# EAGLE design Laptimer (EAGLE 6.3)
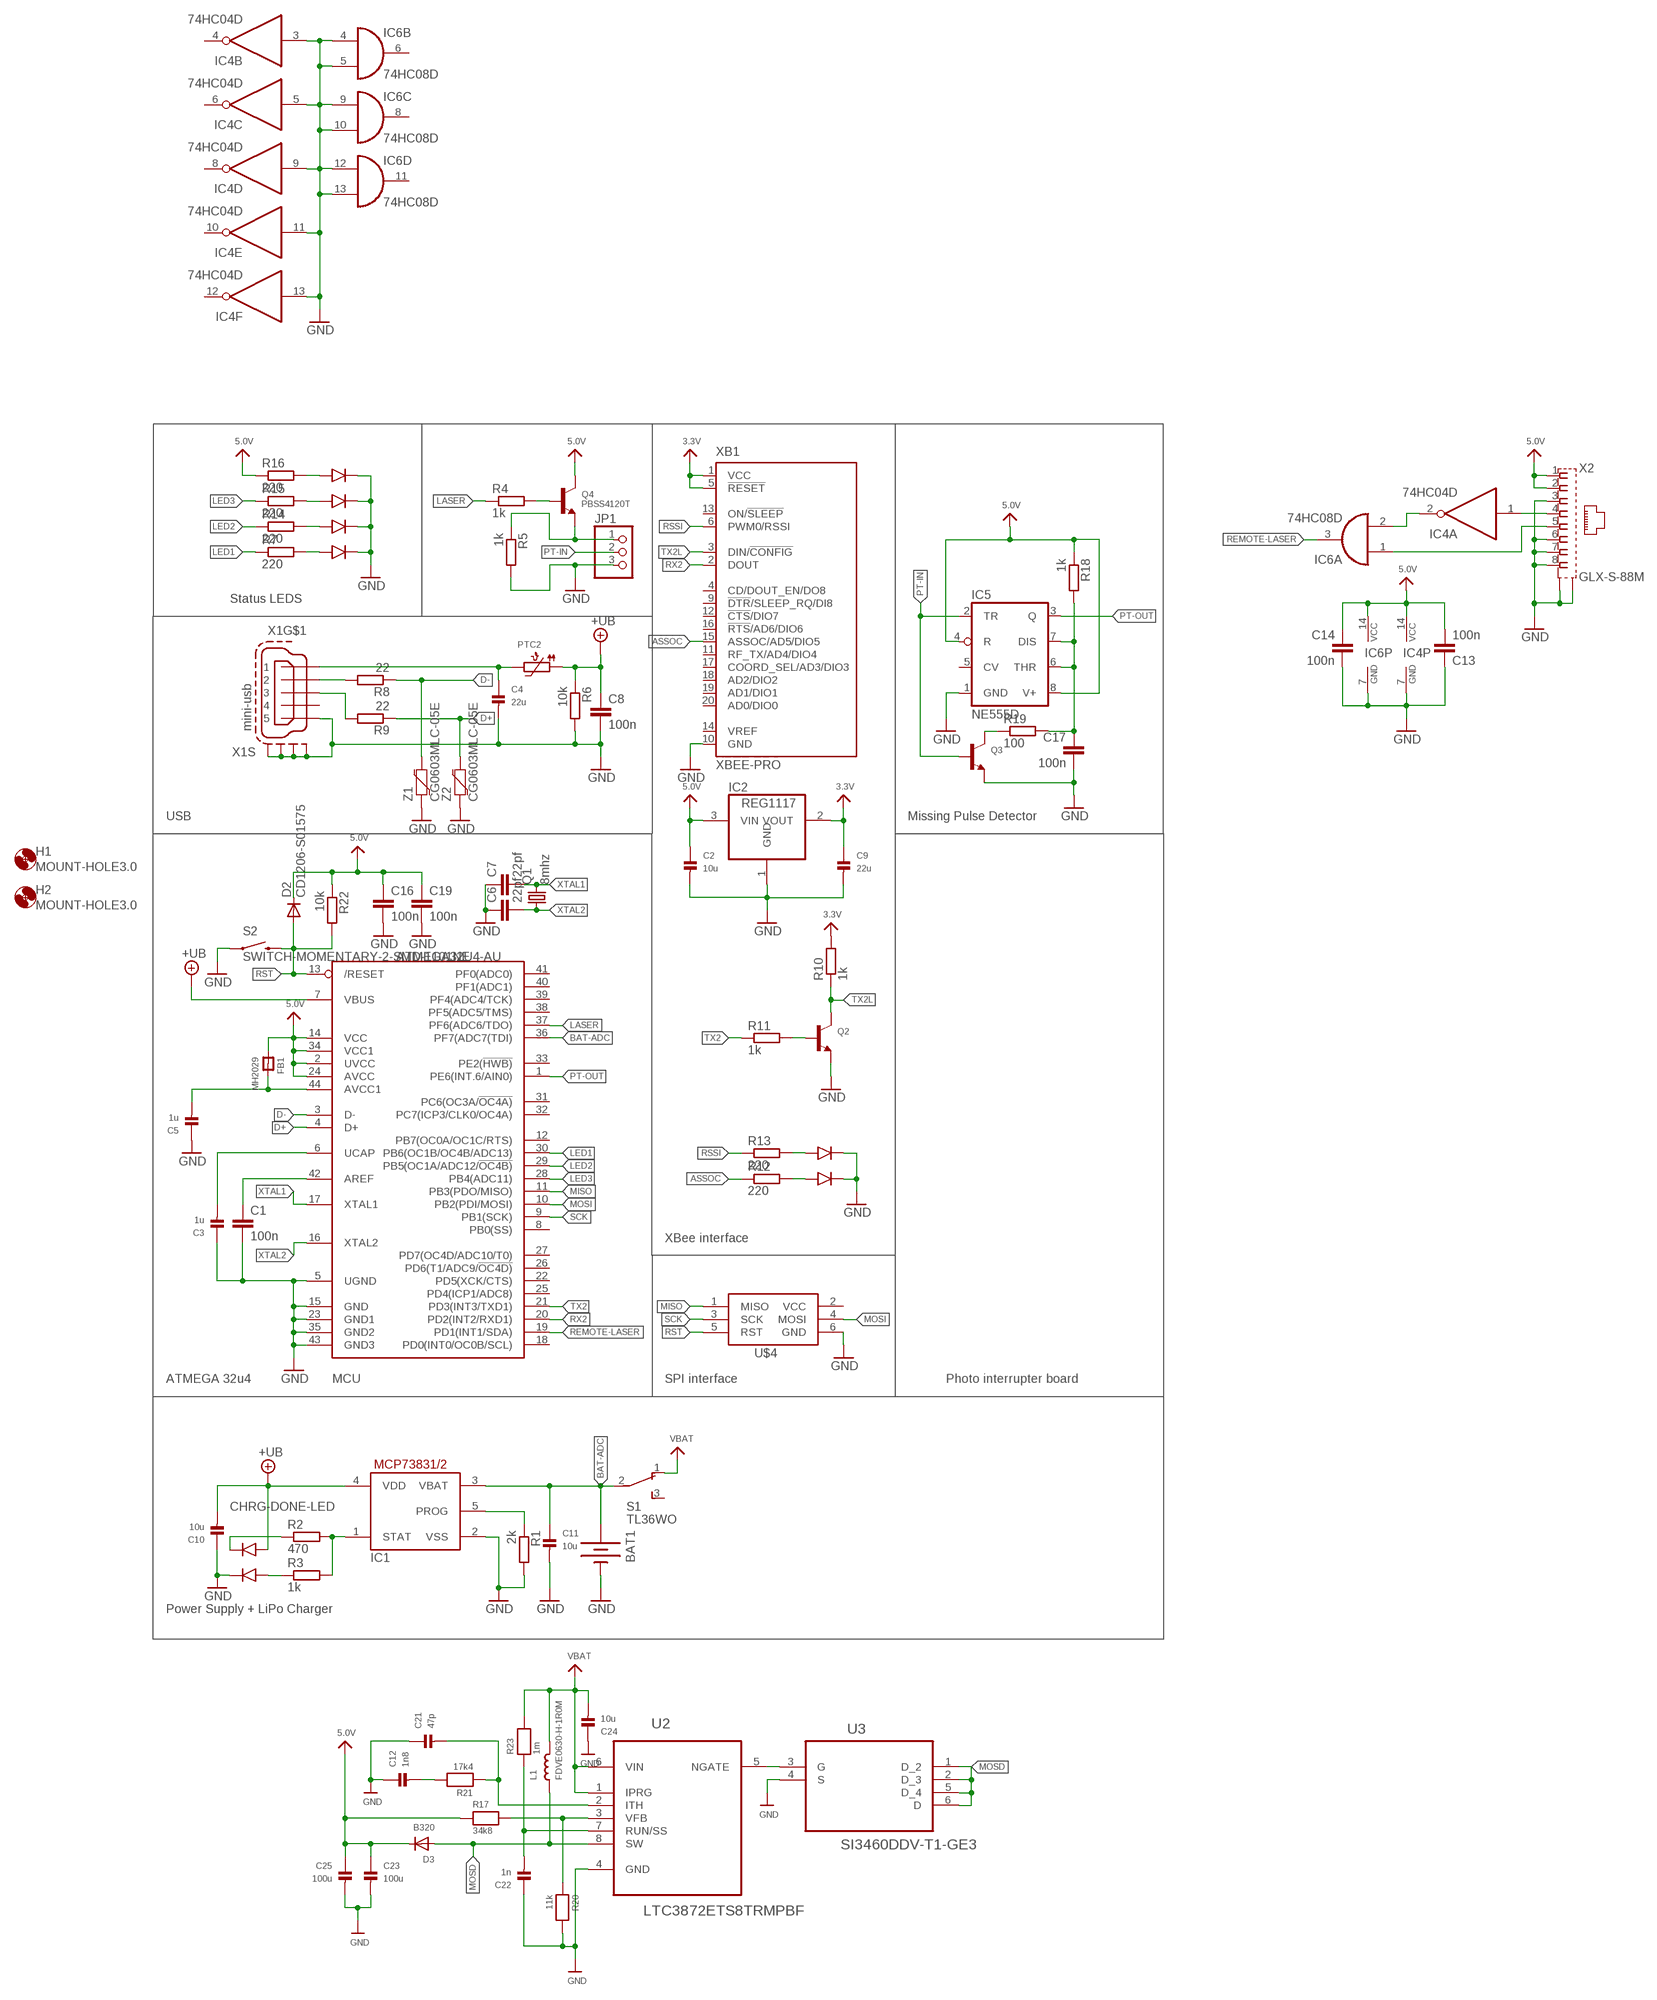
[diagram p0: schematic, sheet 1]

## Parts
BAT1  BATTERY18650  [BATTERY_18650-HOLDER]
C1  100n  C-EUC0603K  [C0603K]
C2  10u  CAP_CERAMIC_0805  [_0805]
C3  1u  CAP_CERAMIC_0805MP  [_0805MP]
C4  22u  CAP_CERAMIC_0805MP  [_0805MP]
C5  1u  CAP_CERAMIC_0805MP  [_0805MP]
C6  22pf  C-EUC0603K  [C0603K]
C7  22pf  C-EUC0603K  [C0603K]
C8  100n  C-EUC0603K  [C0603K]
C9  22u  CAP_CERAMIC_0805  [_0805]
C10  10u  CAP_CERAMIC_0805MP  [_0805MP]
C11  10u  CAP_CERAMIC_0805MP  [_0805MP]
C12  1n8  CAP_CERAMIC_0603  [_0603]
C13  100n  C-EUC0603K  [C0603K]
C14  100n  C-EUC0603K  [C0603K]
C16  100n  C-EUC0603K  [C0603K]
C17  100n  C-EUC0603K  [C0603K]
C19  100n  C-EUC0603K  [C0603K]
C21  47p  CAP_CERAMIC_0603  [_0603]
C22  1n  CAP_CERAMIC_0603  [_0603]
C23  100u  CAP_CERAMIC1206  [1206]
C24  10u  CAP_CERAMIC_0805  [_0805]
C25  100u  CAP_CERAMIC1206  [1206]
D2  CD1206-S01575  DIODE-MINIMELF  [MINIMELF]
D3  B320  DIODESMA  [SMADIODE]
FB1  MH2029  FERRITE_0805MP  [_0805MP]
H1  MOUNT-HOLE3.0  [3,0]
H2  MOUNT-HOLE3.0  [3,0]
IC1  MCP73831/OT  [SOT23-5L]
IC2  REG1117  [SOT223]
IC4  74HC04D  [SO14]
IC5  NE555D  [SO08]
IC6  74HC08D  [SO14]
JP1  PINHD-1X3  [1X03]
L1  FDVE0630-H-1R0M  INDUCTORTDK_SLF6045  [INDUCTOR_6X6MM_TDK_SLF6045]
MCU  ATMEGA32U4-AU  [TQFP44]
PTC2  PTC1206  [1206]
Q1  8mhz  CRYSTALHC49S  [HC49/S]
Q2  TRANSISTOR_NPNWIDE  [SOT23-WIDE]
Q3  TRANSISTOR_NPNWIDE  [SOT23-WIDE]
Q4  PBSS4120T  TRANSISTOR_NPNWIDE  [SOT23-WIDE]
R1  2k  R-EU_R0603  [R0603]
R2  470  R-EU_R0603  [R0603]
R3  1k  R-EU_R0603  [R0603]
R4  1k  R-EU_R0603  [R0603]
R5  1k  R-EU_R0603  [R0603]
R6  10k  R-EU_R0603  [R0603]
R7  220  R-EU_R0603  [R0603]
R8  22  R-EU_R0603  [R0603]
R9  22  R-EU_R0603  [R0603]
R10  1k  R-EU_R0603  [R0603]
R11  1k  R-EU_R0603  [R0603]
R12  220  R-EU_R0603  [R0603]
R13  220  R-EU_R0603  [R0603]
R14  220  R-EU_R0603  [R0603]
R15  220  R-EU_R0603  [R0603]
R16  220  R-EU_R0603  [R0603]
R17  34k8  RESISTOR_0603  [_0603]
R18  1k  R-EU_R0603  [R0603]
R19  100  R-EU_R0603  [R0603]
R20  11k  RESISTOR_0603  [_0603]
R21  17k4  RESISTOR_0603  [_0603]
R22  10k  R-EU_R0603  [R0603]
R23  1m  RESISTOR_0603  [_0603]
S1  TL36WO  [TL3XWO]
S2  SWITCH-MOMENTARY-2-SMD-1101NE  [TACTILE-SWITCH-1101NE]
U2  LTC3872ETS8TRMPBF  [SOT65P280X100-8N]
U3  SI3460DDV-T1-GE3  SI3457CDV-T1-GE3  [SOT95P285X110-6N]
U$1  BI-LEVEL-LED-INDICATOR  [BI-LEVEL-LED-INDICATOR]
U$4  AVRISP-BOX  [AVRISP-BOX]
U$11  BI-LEVEL-LED-INDICATOR  [BI-LEVEL-LED-INDICATOR]
U$18  BI-LEVEL-LED-INDICATOR  [BI-LEVEL-LED-INDICATOR]
U$19  BI-LEVEL-LED-INDICATOR  [BI-LEVEL-LED-INDICATOR]
X1  mini-usb  MINI-USB-SCHIELD-32005-301  [32005-301]
X2  GLX-S-88M  [GLX-S-88M]
XB1  XBEE-PRO  [XBEE-PRO]
Z1  CG0603MLC-05E  VARISTOR-0603  [0603-RES]
Z2  CG0603MLC-05E  VARISTOR-0603  [0603-RES]

## Nets
1D+: R9.2 X1.3
1D-: R8.2 X1.2
3.3V: C9.1 IC2.2(VOUT) R10.2 XB1.1(VCC) XB1.5(!RESET)
5.0V: C2.1 C13.2 C14.1 C16.1 C19.1 C23.1 C25.1 D2.C D3.C FB1.1 IC2.3(VIN) IC4.14(P:VCC) IC5.4(R) IC5.8(V+) IC6.14(P:VCC) MCU.2(UVCC) MCU.14(VCC) MCU.24(AVCC) MCU.34(VCC1) Q4.3(C) R16.1 R17.1 R18.1 R22.1 X2.1 X2.2
+UB: C8.1 C10.2 IC1.4(VDD) MCU.7(VBUS) PTC2.1 R6.1 U$1.ANODE1
ASSOC: R12.1 XB1.15(ASSOC/AD5/DIO5)
BAT-ADC: BAT1.PWR@1(+) C11.1 IC1.3(VBAT) MCU.36(PF7(ADC7(TDI)) S1.2(P)
CHRG-DONE-LED: R3.1 U$1.ANODE2
D+: MCU.4(D+) R9.1 Z2.2
D-: MCU.3(D-) R8.1 Z1.2
GND: BAT1.GND@1(-) C1.2 C2.2 C3.1 C4.2 C5.1 C6.1 C7.1 C8.2 C9.2 C10.1 C11.2 C12.1 C13.1 C14.2 C16.2 C17.2 C19.2 C21.1 C22.1 C23.2 C24.1 C25.2 IC1.2(VSS) IC2.1(GND) IC4.3(B:I) IC4.5(C:I) IC4.7(P:GND) IC4.9(D:I) IC4.11(E:I) IC4.13(F:I) IC5.1(GND) IC6.4(B:I0) IC6.5(B:I1) IC6.7(P:GND) IC6.9(C:I0) IC6.10(C:I1) IC6.12(D:I0) IC6.13(D:I1) JP1.3 MCU.5(UGND) MCU.15(GND) MCU.23(GND1) MCU.35(GND2) MCU.43(GND3) Q2.2(E) Q3.2(E) R1.2 R5.2 R6.2 R20.2 S2.P$1 U2.4(GND) U3.4(S) U$1.CATHODE2 U$4.6(GND) U$11.CATHODE1 U$11.CATHODE2 U$18.CATHODE1 U$18.CATHODE2 U$19.CATHODE1 U$19.CATHODE2 X1.5 X1.M1(S:S1) X1.M2(S:S2) X1.M3(S:S3) X1.M4(S:S4) X2.3 X2.6 X2.7 X2.8 X2.S1 X2.S2 XB1.10(GND) Z1.1 Z2.1
LASER: MCU.37(PF6(ADC6/TDO)) R4.1
LED1: MCU.30(PB6(OC1B/OC4B/ADC13)) R7.1
LED2: MCU.29(PB5(OC1A/ADC12/!OC4B)) R14.1
LED3: MCU.28(PB4(ADC11)) R15.1
MISO: MCU.11(PB3(PDO/MISO)) U$4.1(MISO)
MOSD: D3.A L1.P$1 U2.8(SW) U3.1(D_2) U3.2(D_3) U3.5(D_4) U3.6(D)
MOSI: MCU.10(PB2(PDI/MOSI)) U$4.4(MOSI)
N$1: R17.2 R20.1 U2.3(VFB)
N$2: C12.2 R21.2
N$3: IC1.5(PROG) R1.1
N$4: IC1.1(STAT) R2.2 R3.2
N$5: JP1.1 Q4.2(E) R5.1
N$6: Q4.1(B) R4.2
N$7: C5.2 FB1.2 MCU.44(AVCC1)
N$8: U2.5(NGATE) U3.3(G)
N$9: C1.1 MCU.42(AREF)
N$12: C3.2 MCU.6(UCAP)
N$13: C4.1 PTC2.2 X1.1
N$14: R2.1 U$1.CATHODE1
N$15: R7.2 U$18.ANODE1
N$17: R12.2 U$11.ANODE1
N$18: Q2.1(B) R11.2
N$19: R13.2 U$11.ANODE2
N$20: IC4.1(A:I) X2.4
N$21: R14.2 U$18.ANODE2
N$22: IC6.1(A:I0) X2.5
N$25: R15.2 U$19.ANODE1
N$27: C21.2 R21.1 U2.2(ITH)
N$28: IC4.2(A:O) IC6.2(A:I1)
N$29: C22.2 R23.1 U2.7(RUN/SS)
N$32: R16.2 U$19.ANODE2
N$36: C17.1 IC5.6(THR) IC5.7(DIS) R18.2 R19.2
N$41: Q3.3(C) R19.1
PT-IN: IC5.2(TR) JP1.2 Q3.1(B)
PT-OUT: IC5.3(Q) MCU.1(PE6(INT.6/AIN0))
REMOTE-LASER: IC6.3(A:O) MCU.19(PD1(INT1/SDA))
RSSI: R13.1 XB1.6(PWM0/RSSI)
RST: D2.A MCU.13(/RESET) R22.2 S2.P$2 U$4.5(RST)
RX2: MCU.20(PD2(INT2/RXD1)) XB1.2(DOUT)
SCK: MCU.9(PB1(SCK)) U$4.3(SCK)
TX2: MCU.21(PD3(INT3/TXD1)) R11.1
TX2L: Q2.3(C) R10.1 XB1.3(DIN/!CONFIG)
VBAT: C24.2 L1.P$2 R23.2 S1.1(O) U2.1(IPRG) U2.6(VIN)
XTAL1: C7.2 MCU.17(XTAL1) Q1.2
XTAL2: C6.2 MCU.16(XTAL2) Q1.1
Unconnected: IC4.4(B:O) IC4.6(C:O) IC4.8(D:O) IC4.10(E:O) IC4.12(F:O) IC5.5(CV) IC6.6(B:O) IC6.8(C:O) IC6.11(D:O) MCU.8(PB0(SS)) MCU.12(PB7(OC0A/OC1C/RTS)) MCU.18(PD0(INT0/OC0B/SCL)) MCU.22(PD5(XCK/CTS)) MCU.25(PD4(ICP1/ADC8)) MCU.26(PD6(T1/ADC9/!OC4D)) MCU.27(PD7(OC4D/ADC10/T0)) MCU.31(PC6(OC3A/!OC4A)) MCU.32(PC7(ICP3/CLK0/OC4A)) MCU.33(PE2(!HWB)) MCU.38(PF5(ADC5/TMS)) MCU.39(PF4(ADC4/TCK)) MCU.40(PF1(ADC1)) MCU.41(PF0(ADC0)) S1.3(S) X1.4 XB1.4(CD/DOUT_EN/DO8) XB1.9(!DTR!/SLEEP_RQ/DI8) XB1.11(RF_TX/AD4/DIO4) XB1.12(!CTS!/DIO7) XB1.13(ON/!SLEEP) XB1.14(VREF) XB1.16(!RTS!/AD6/DIO6) XB1.17(COORD_SEL/AD3/DIO3) XB1.18(AD2/DIO2) XB1.19(AD1/DIO1) XB1.20(AD0/DIO0)

## Notes on the sheet
- Status LEDS
- USB | Missing Pulse Detector
- XBee interface
- ATMEGA 32u4 | SPI interface | Photo interrupter board
- Power Supply + LiPo Charger

## Power pins joined to a net without a drawn wire
VCC: U$4.2(VCC)

## Library data of the parts
BAT1 = SparkFun-Electromechanical:BATTERY: Battery Holders Various common sizes : AA, AAA, 18650 (PRT-12895), 20mm coin cell and 12mm coin cell. 20MM_4LEGS, BATT-10373
C1 C6-C8 C13 C14 C16 C17 C19 = rcl:C-EU: CAPACITOR, European symbol
C2-C5 C9-C12 C21-C25 = microbuilder:CAP_CERAMIC: Ceramic Capacitors 0402 - 0402 Surface Mount Capacitors 16pF 50V 5% [Digikey: 445-4899-2-ND] 18pF 50V 5% [Digikey: 490-1281-2-ND] 22pF 50V 5% [Digikey: 490-1283-2-ND] 68pF 50V 5% [Digikey: 490-1289-2-ND] 0.1uF 10V 10% [Digikey: 490-1318-2-ND] 1.0uF 6.3V 10% [Digikey: 490-1320-2-ND] 0603 - 0603 Surface Mount Capacitors 16 pF 50V 5% [Digikey: 445-5051-2-ND] 22 pF 50V [Digikey: PCC220ACVTR-ND] 33 pF 50V 5% [Digikey: 490-1415-1-ND] 56pF 50V 5% [Digikey: 490-1421-1-ND] 220pF 50V 5% [Digikey: 445-1285-1-ND] 680 pF 50V 2200 pF 50V 5% C0G [Digikey: 445-1297-1-ND] 5600 pF 100V 5% X7R [Digikey: 478-3711-1-ND] 0.1 µF 25V 10% [Digikey: PCC2277TR-ND] 0.22 µF 16V 10% X7R [Digikey: 445-1318-1-ND] 1.0 µF 25V 10% [Digikey: 445-5146-2-ND] 0603 - RF Specific 3pF 250V +/-0.1pF RF [Digikey: 712-1347-1-ND] 18 pF 250V 5% [Digikey: 478-3505-1-ND or 712-1322-1-ND] 56 pF 250V 5% C0G RF [Digikey: 490-4867-1-ND] 68 pF 250V RF [Digikey: 490-4868-1-ND] 0805 - 0805 Surface Mount Capacitors 220 pF 250V 2% RF Ceramic Capacitor [Digikey: 712-1398-1-ND] 1000 pF 50V 2% NP0 Ceramic Capacitor [Digikey: 478-3760-1-ND] 0.1 µF 25V 10% Ceramic Capacitor [Digikey: PCC1828TR-ND] 1.0 µF 16V 10% Ceramic Capacitor[Digikey: 490-1691-2-ND] 10.0 µF 10V 10% Ceramic Capacitor[Digikey: 709-1228-1-ND] 10.0 uF 16V 10% Ceramic Capacitor [Digikey: 478-5165-2-ND] 47 uF 6.3V 20% Ceramic Capacitor [Digikey: 587-1779-1-ND or 399-5506-1-ND] 1206 - 1206 Surface Mount Capacitors 47uF 10V 20% Ceramic Capacitor [Digikey: 490-5528-1-ND or 399-5508-1-ND or 445-6010-1-ND] 100uF 6.3V -20%, +80% Y5V Ceramic Capacitor (Digikey: 490-4512-1-ND, Mouser: 81-GRM31CF50J107ZE1L)
D2 = diode:DIODE-: DIODE
D3 = adafruit:DIODE: Diode SMADIODE - SMA Surface Mount Package 20V 1A Schottky Diode Digikey: 641-1014-6-ND DO-1N4148 - Through Hole Small Current Diode SOD-123 20V 1 A (.5mV Vf) Schottky Diode - Digikey: MBRX120TPMSCT-ND SOD-323 10V 570mA (.38mV Vf, 3ns) Schottky Diode - Digikey: ZLLS410CT-ND SOD-523 30V 30mA Schottky Diode (RB751S-40TE61) - Digikey: RB751S-40TE61CT-ND SOT23-R/W - SOT23 Package (R = Solder Paste/Reflow Ovens, W = Hand-Soldering) BAT54Film 40V 300mA - Digikey: 497-7162-1-ND
FB1 = microbuilder:FERRITE: Ferrite Bead 0603 MMZ1608B121C - 120 Ohm @ 100MHz, 600mA, 0.15 Ohm DC Resistance - Digikey: 445-2164-1-ND BK1608HW121-T - 120 Ohm, 600mA Ferrite Chip - Digikey: 587-1876-2-ND 0805 HZ0805B272R-10 - 2.7K Ohm @ 100MHz, 200mA, 0.8 Ohm DC Resistance - Digikey: 240-2504-1-ND (see also Murata BLM21BD272SN1L) MMZ2012Y152B - 1.5K Ohm @ 100MHz, 500mA, 0.4 Ohm DC Resistance - Digikey: 445-1560-1-ND - Mainly for high frequency (80-400MHz) MMZ2012R102A - 1K Ohm @ 100MHz, 500mA, 0.3 Ohm DC Resistance - Digikey: 445-1555-2-ND - More general purpose (10-200MHz)
H1 H2 = holes:MOUNT-HOLE: MOUNTING HOLE with drill center marker
IC1 = adafruit:MCP73831: MCP73831/2 Miniature Single-Cell, Fully Integrated Li-Ion, Li-Polymer Charge Management Controllers. Nice and small simple lipoly charge controller, with adjustable current and status output (LED) http://www.ladyada.net/library/pcb/eaglelibrary.html
IC2 = burr-brown:REG1117: 800mA and 1A Low Dropout (LDO) Positive Regulator 1.8V, 2.5V, 2.85V, 3.3V, 5V, and Adj; MPN: REG1117; OC_FARNELL: 1097566; OC_NEWARK: 14P6981
IC4 = 74xx-eu:74*04: Hex INVERTER
IC5 = linear:*555: TIMER
IC6 = 74xx-eu:74*08: Quad 2-input AND gate
JP1 = adafruit:PINHD-1X3: PIN HEADER
L1 = microbuilder:INDUCTOR: Inductors 0603: 10nH Ceramic Inductor - microwire antenna/RF (Digikey: 712-1434-2-ND) 0805: 560nH Ceramic Inductor - RF (Digikey: 553-1047-1-ND) 270nH Ceramic Inductor - Q = 40@250MHz, +-5%, 1 Ohm DC Resistance (Digikey: 535-10506-2-ND) 1007 (2518 Metric) SMT: 10µH 10% 250mOhm 820mA 1007 Inductor (Digikey: 587-2189-1-ND) 22µH 10% 500mOhm 580mA 1007 Inductor (Digikey: 587-2190-1-ND) 47µH 10% 950mOhm 420mA 1007 Inductor (Digikey: 587-2191-1-ND) 47µH 5% 100mOhm 1A 1008 Inductor (Digikey: 732-1816-1-ND) 5.0x5.0mm (Taiyo Yuden NR5040 Series) 6.8µH 20% 2.3A 64mOhm Inductor (Digikey: 587-2374-2-ND) 5.0x5.0mm (TDK VLC5045 Series) 4.7µH 20% 3.3A 34mOhm Inductor (Digikey: 445-6526-1-ND) 6.8µH 20% 2.7A 46mOhm Inductor (Digikey: 445-6527-1-ND) 6.0x6.0mm (TDK VLC6045 Series) 4.7µH 20% 3.8A 27mOhm Inductor (Digikey: 445-6538-2-ND) 6.8µH 20% 3A 41mOhm Inductor (Digikey: 445-6540-1-ND) 6.2µH 30% 2.2A 45mOhm Inductor (Digikey: SRR5028-6R2YCT-ND) - Not TDK VLC6045 but footprint should match 6.0x6.0mm (TDK SLF6045 Series) 6.8uH 30% 2A 33mOhm Inductor (Digikey: 445-4572-1-ND, Mouser: 810-SLF645T6R8N2R0PF)
MCU = adafruit:ATMEGA32U4: http://www.ladyada.net/library/eagle
PTC2 = microbuilder:PTC: PTC (Resettable Fuse) 1206 Package 250mA PTC (16V Max, Time-to-Trip: 0.08s) - Digikey: F2110CT-ND 1210 Package 100mA PTC (30V Max, Time-to-Trip: 0.6s) - Digikey: MF-USMF010-2CT-ND 1812 Package 750mA PTC (24V Max, Time-to-Trip: 0.2s) - Digikey: MF-MSMF075/24-2CT-ND
Q1 = adafruit:CRYSTAL: CRYSTAL; OC_FARNELL: 1667008; OC_NEWARK: unknown
Q2-Q4 = microbuilder:TRANSISTOR_NPN: NPN Transistor Transistor (NPN) 500mA 45V - BC817 [Digikey: 568-1631-1-ND] Transistor (NPN) 500mA 45V - BC817,215 [Mouser: 771-BC817-T/R] SOT23-R - SOT23 footprint optimised for use with solder paste and reflow ovens. SOT23-W - SOT23 footprint optimised for hand-soldering (larger pads).
R1-R16 R18 R19 R22 = rcl:R-EU_: RESISTOR, European symbol
R17 R20 R21 R23 = microbuilder:RESISTOR: Resistors 0402 - 0402 Surface Mount Package 22 Ohm 1% 1/16W [Digikey: 311-22.0LRTR-ND] 33 Ohm 5% 1/16W 1.0K 5% 1/16W 1.5K 5% 1/16W 2.0K 1% 1/16W 10.0K 1% 1/16W [Digikey: 311-10.0KLRTR-ND] 10.0K 5% 1/16W [Digikey: RMCF0402JT10K0TR-ND] 12.1K 1% 1/16W [Digikey: 311-22.0LRTR-ND] 100.0K 5% 1/16W 0603 - 0603 Surface Mount Package 0 Ohm 1/10 Watt 1% Resistor 15 Ohm 1/10 Watt 1% Resistor 33 Ohm 1/10 Watt 1% Resistor 49.9 Ohm 1/10 Watt 1% Resistor 100 Ohm 1/10 Watt 1% Resistor 150 Ohm 1/10 Watt 1% Resistor 240 Ohm 1/10 Watt 1% Resistor 390 Ohm 1/10 Watt 1% Resistor 560 Ohm 1/10 Watt 1% Resistor 680 Ohm 1/10 Watt 1% Resistor 750 Ohm 1/10 Watt 1% Resistor 1.0K Ohm 1/10 Watt 1% Resistor 1.5K Ohm 1/10 Watt 1% Resistor 2.0K Ohm 1/10 Watt 1% Resistor 2.2K Ohm 1/10 Watt 1% Resistor 3.3K Ohm 1/10 Watt 1% Resistor 4.7K Ohm 1/10 Watt 1% Resistor 10.0K Ohm 1/10 Watt 1% Resistor 12.0K Ohm 1/10 Watt 1% Resistor 12.1K Ohm 1/10 Watt 1% Resistor 20.0K Ohm 1/10 Watt 1% Resistor 33.0K Ohm 1/10 Watt 1% Resistor 100.0K Ohm 1/10 Watt 1% Resistor 0805 - 0805 Surface Mount Package 0 Ohm 1/8 Watt 1% Resistor 33 Ohm 1/8 Watt 1% Resistor 100 Ohm 1/8 Watt 1% Resistor 150 Ohm 1/8 Watt 1% Resistor 200 Ohm 1/8 Watt 1% Resistor 240 Ohm 1/8 Watt 1% Resistor 330 Ohm 1/8 Watt 1% Resistor 390 Ohm 1/8 Watt 1% Resistor 470 Ohm 1/8 Watt 1% Resistor 1.0K Ohm 1/8 Watt 1% Resistor 1.5K Ohm 1/8 Watt 1% Resistor 2.0K Ohm 1/8 Watt 1% Resistor 4.7K Ohm 1/8 Watt 1% Resistor 5.1K Ohm 1/8 Watt 1% Resistor 5.6K Ohm 1/8 Watt 1% Resistor 10.0K Ohm 1/8 Watt 1% Resistor 22.0K Ohm 1/8 Watt 1% Resistor 33.0K Ohm 1/8 Watt 1% Resistor 100K Ohm 1/8 Watt 1% Resistor 1206 - 1206 Surface Mount Package 2012 - 2010 Surface Mount Package 0.11 Ohm 1/2 Watt 1% Resistor - Digikey: RHM.11UCT-ND
S1 = switch:TL36WO: TINY SWITCH ON - ON Source: http://www2.produktinfo.conrad.com/datenblaetter/700000-724999/705152-da-01-de-Subminiaturschalter_TL_36WO.pdf
S2 = SparkFun-Electromechanical:SWITCH-MOMENTARY-2: Various NO switches- pushbuttons, reed, etc
U2 = LTC_By_element14_Batch_1:LTC3872ETS8TRMPBF: DC/DC Controller; MPN: LTC3872ETS8#TRMPBF; OC_FARNELL: 1556409; OC_NEWARK: 56M8617; PACKAGE: SOT-23-8; SUPPLIER: LINEAR TECHNOLOGY
U3 = Vishay_By_element14_Batch_1:SI3457CDV-T1-GE3: N-Channel 30-V (D-S) MOSFET; MPN: SI3457CDV-T1-GE3; OC_FARNELL: 1840420; OC_NEWARK: 90R9127; PACKAGE: TSOP-6; SUPPLIER: Vishay Siliconix
U$1 U$11 U$18 U$19 = unicorn_v2:BI-LEVEL-LED-INDICATOR
U$4 = adafruit:AVRISP: AVR ISP HEADER Standard 6 pin header for AVR programming
X1 = con-cypressindustries:MINI-USB-SCHIELD-: MINI USB-B Conector Source: www.cypressindustries.com; OC_FARNELL: unknown; OC_NEWARK: unknown
X2 = con-kycon:GLX-S-88M: Mod. Jack, Right Angle, 8 posiotion, 8 contatcs RJ45 Source: GLX-S-88M.pdf; OC_FARNELL: unknown; OC_NEWARK: unknown
XB1 = microbuilder:XBEE: XBee (TM) /XBee-PRO(TM) OEM RF Modules Source: MaxStream, Inc. xbee_productmanual.pdf
Z1 Z2 = SparkFun-DiscreteSemi:VARISTOR: Varistor Varistor (Variable resistor) is a nonlinear resistive element of the voltage dependence that resistance changes with applied voltage. Varistor is equivalent with Zener diode of two series connection.

## Board
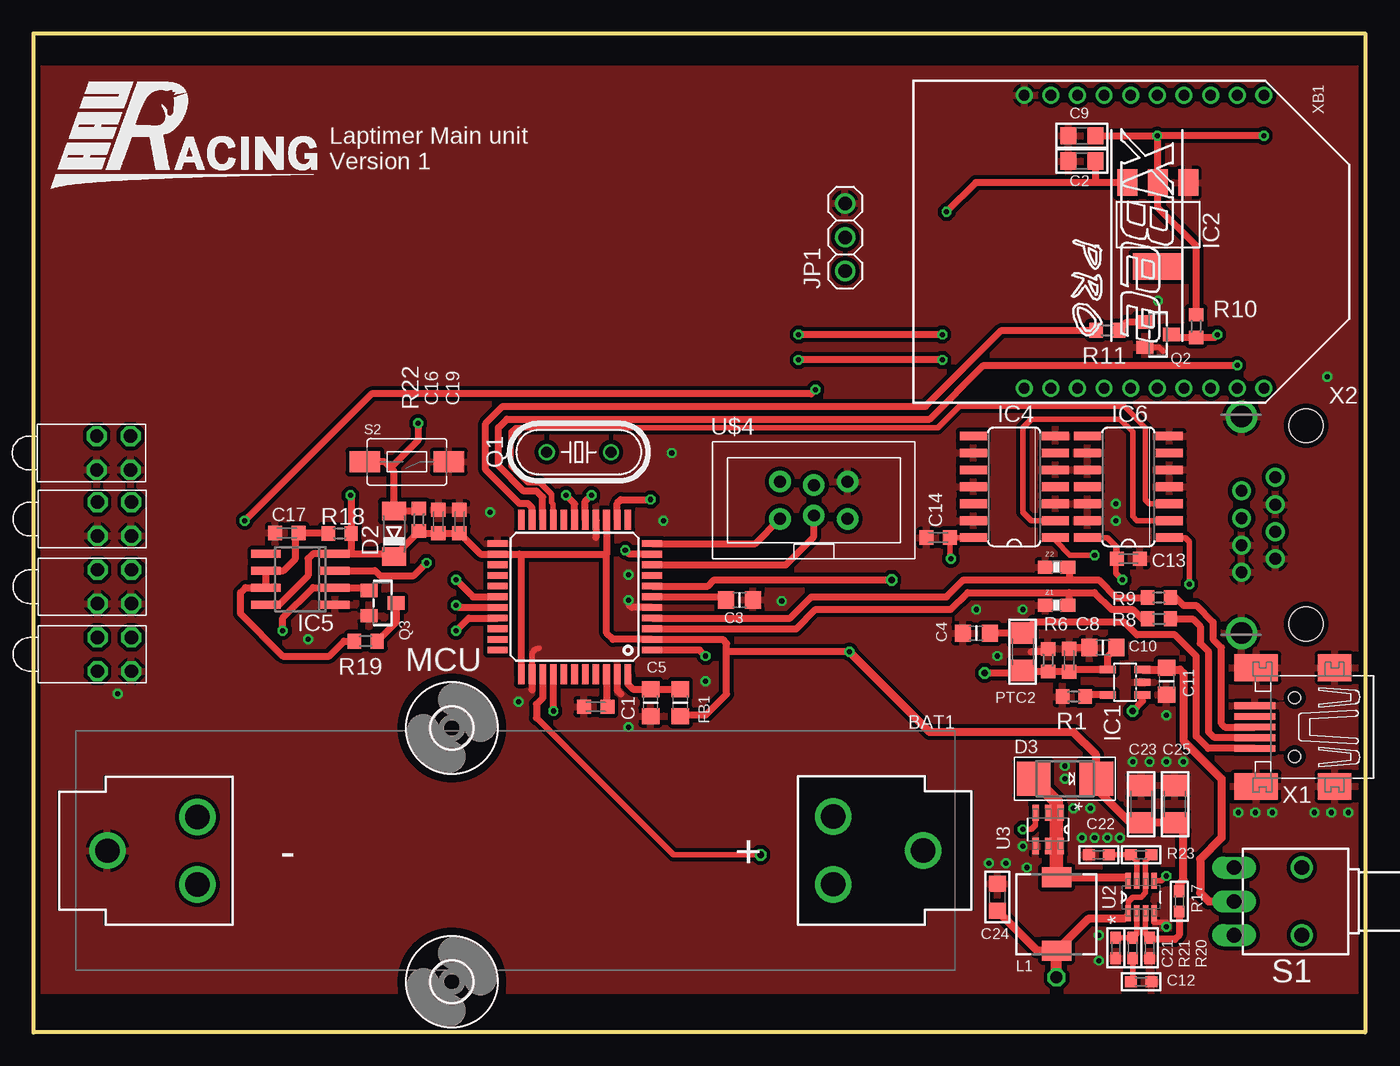
[diagram p1: board, top side]
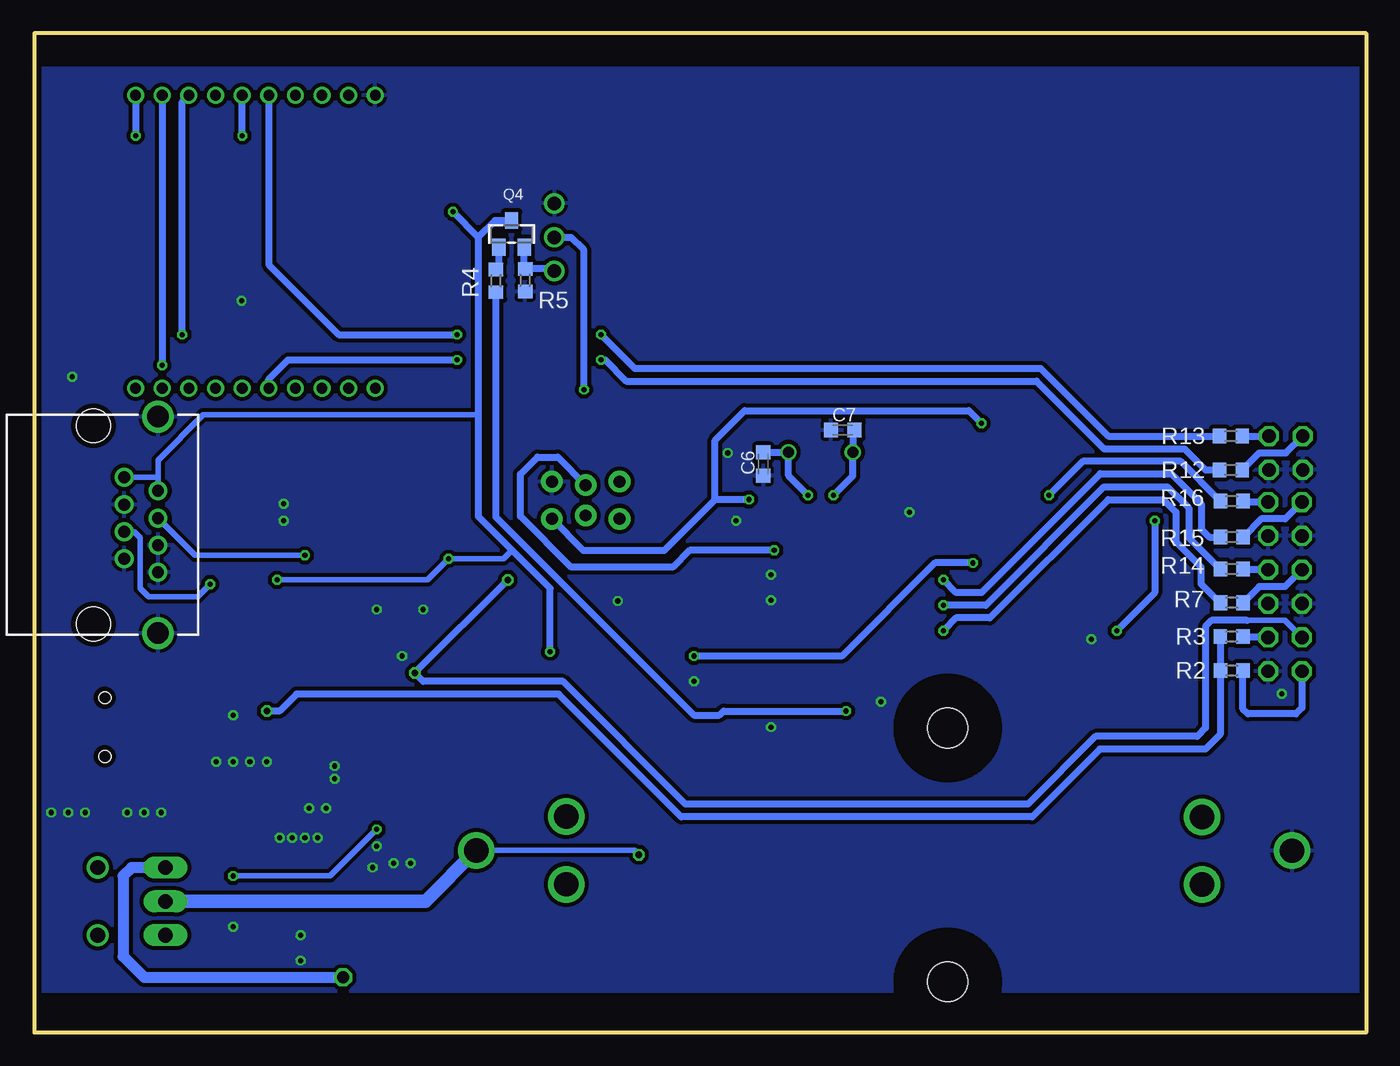
[diagram p2: board, bottom side, seen from below]

Size 100 x 75 mm. Coordinates in mm from the lower left corner, seen from the top.
Outline: 0,75 100,75 100,0 0,0 0,75
Copper layers (1*16): Top 0.0356mm / dielectric 1.5011mm / Bottom 0.0356mm
Design rules "LaenPCBOrder *": minimum track width 6mil, minimum drill 13mil, track to track 12mil, track to pad 12mil, pad to pad 12mil, via to via 12mil, smd to smd 12mil, copper to edge 15mil, drill to drill 6mil, minimum pad ring 7mil, minimum via ring 7mil, stop-mask expansion 3mil, vias tented up to drill 0mil, thermal gap 10mil

### Footprints (pad centres in the part's own frame; a part is rotated, then mirrored left to right if it is on the bottom)
BATTERY_18650-HOLDER = drill 1.829: GND@1 30.628,0.01; GND@2 23.88,2.55; GND@3 23.88,-2.53; PWR@1 -30.628,-0.01; PWR@2 -23.88,2.53; PWR@3 -23.88,-2.55
C0603K = smd 1.05 x 1.08: 1 -0.875,0; 2 0.875,0
_0805 = smd 1.2 x 1.3: 1 -1.016,0; 2 1.016,0
_0805MP = smd 1.2 x 1.3: 1 -1.016,0; 2 1.016,0
_0603 = smd 0.9 x 0.8: 1 -0.762,0; 2 0.762,0
1206 = smd 1.6 x 1.8: 1 -1.4,0; 2 1.4,0
MINIMELF = smd 1.4 x 1.8: A 1.7,0; C -1.7,0
SMADIODE = smd 2.54 x 2.54: A 2.349,0; C -2.349,0
3,0 = hole 3: 0,0
SOT23-5L = smd 0.55 x 1.2: 1 -0.95,-1.3; 2 0,-1.3; 3 0.95,-1.3; 4 0.95,1.3; 5 -0.95,1.3
SOT223 = smd 1.499 x 2.007: 1 -2.261,-3.15; 2 0.025,-3.15; 3 2.311,-3.15 | smd 3.81 x 2.007: 4 0,3.15
SO14 = smd 0.66 x 2.032: 1 -3.81,-3.073; 2 -2.54,-3.073; 3 -1.27,-3.073; 4 0,-3.073; 5 1.27,-3.073; 6 2.54,-3.073; 7 3.81,-3.073; 8 3.81,3.073; 9 2.54,3.073; 10 1.27,3.073; 11 0,3.073; 12 -1.27,3.073; 13 -2.54,3.073; 14 -3.81,3.073
SO08 = smd 0.6 x 2.2: 1 -1.905,-2.6; 2 -0.635,-2.6; 3 0.635,-2.6; 4 1.905,-2.6; 5 1.905,2.6; 6 0.635,2.6; 7 -0.635,2.6; 8 -1.905,2.6
1X03 = drill 1.016: 1 -2.54,0; 2 0,0; 3 2.54,0
INDUCTOR_6X6MM_TDK_SLF6045 = smd 1.5 x 2.2: P$1 -2.75,0; P$2 2.75,0
TQFP44 = smd 1.5 x 0.5: 1 -5.8,4; 2 -5.8,3.2; 3 -5.8,2.4; 4 -5.8,1.6; 5 -5.8,0.8; 6 -5.8,0; 7 -5.8,-0.8; 8 -5.8,-1.6; 9 -5.8,-2.4; 10 -5.8,-3.2; 11 -5.8,-4; 23 5.8,-4; 24 5.8,-3.2; 25 5.8,-2.4; 26 5.8,-1.6; 27 5.8,-0.8; 28 5.8,0; 29 5.8,0.8; 30 5.8,1.6; 31 5.8,2.4; 32 5.8,3.2; 33 5.8,4 | smd 0.5 x 1.5: 12 -4,-5.8; 13 -3.2,-5.8; 14 -2.4,-5.8; 15 -1.6,-5.8; 16 -0.8,-5.8; 17 0,-5.8; 18 0.8,-5.8; 19 1.6,-5.8; 20 2.4,-5.8; 21 3.2,-5.8; 22 4,-5.8; 34 4,5.8; 35 3.2,5.8; 36 2.4,5.8; 37 1.6,5.8; 38 0.8,5.8; 39 0,5.8; 40 -0.8,5.8; 41 -1.6,5.8; 42 -2.4,5.8; 43 -3.2,5.8; 44 -4,5.8
HC49/S = drill 0.813: 1 -2.413,0; 2 2.413,0
SOT23-WIDE = smd 1 x 1.27: 1 -0.95,-1; 2 0.95,-1; 3 0,1
R0603 = smd 1 x 1.1: 1 -0.85,0; 2 0.85,0
TL3XWO = drill 1.1 pad 1.422 long: 1 -2.54,-5.08; 2 0,-5.08; 3 2.54,-5.08 | drill 1.1 pad 1.676: M1 -2.54,0; M2 2.54,0
TACTILE-SWITCH-1101NE = smd 2.3 x 1.6: P$1 -3.15,0; P$2 3.15,0
SOT65P280X100-8N = smd 1.219 x 0.406: 1 -1.219,0.965; 2 -1.219,0.33; 3 -1.219,-0.33; 4 -1.219,-0.965; 5 1.219,-0.965; 6 1.219,-0.33; 7 1.219,0.33; 8 1.219,0.965
SOT95P285X110-6N = smd 1.219 x 0.508: 1 -1.245,0.94; 2 -1.245,0; 3 -1.245,-0.94; 4 1.245,-0.94; 5 1.245,0; 6 1.245,0.94
BI-LEVEL-LED-INDICATOR = drill 1 octagon: ANODE1 1.27,1.27; ANODE2 1.27,-1.27; CATHODE1 -1.27,1.27; CATHODE2 -1.27,-1.27
AVRISP-BOX = drill 0.9 pad 1.626: 1 -1.397,2.54; 2 1.397,2.54; 3 -1.143,0; 4 1.143,0; 5 -1.397,-2.54; 6 1.397,-2.54
32005-301 = smd 3.1 x 0.5: 1 3,1.6; 2 3,0.8; 3 3,0; 4 3,-0.8; 5 3,-1.6 | smd 2.5 x 2: M1 -3,-4.45; M2 -3,4.45 | smd 3.3 x 2: M3 2.9,4.45; M4 2.9,-4.45 | hole 0.9: 0,2.2; 0,-2.2
GLX-S-88M = drill 0.9 pad 1.422: 1 -3.57,-2.3; 2 -2.55,-4.84; 3 -1.53,-2.3; 4 -0.51,-4.84; 5 0.51,-2.3; 6 1.53,-4.84; 7 2.55,-2.3; 8 3.57,-4.84 | drill 1.6 pad 2.184: S1 -8.125,-4.84; S2 8.125,-4.84 | hole 2.55: -7.44,0; 7.44,0
XBEE-PRO = drill 0.8 pad 1.27: 1 -11,9; 2 -11,7; 3 -11,5; 4 -11,3; 5 -11,1; 6 -11,-1; 7 -11,-3; 8 -11,-5; 9 -11,-7; 10 -11,-9; 11 11,-9; 12 11,-7; 13 11,-5; 14 11,-3; 15 11,-1; 16 11,1; 17 11,3; 18 11,5; 19 11,7; 20 11,9
0603-RES = smd 1.1 x 1: 1 -0.85,0; 2 0.85,0

### Placement (x,y rotation side)
BAT1  36.2,13.65 180 top
C1  42.23,24.45 180 top
C2  78.74,65.41 180 top
C3  53.03,32.46 180 top
C4  70.8,29.97 180 top
C5  46.35,24.77 90 top
C6  45.28,42.67 90 bottom
C7  39.3,45.21 0 bottom
C8  77.79,27.94 90 top
C9  78.74,67.31 180 top
C10  80.33,28.89 0 top
C11  85.09,26.35 270 top
C12  83.19,3.81 180 top
C13  82.23,35.56 180 top
C14  67.94,37.15 180 top
C16  30.42,38.35 90 top
C17  19.05,37.5 180 top
C19  32,38.35 90 top
C21  81.28,6.35 90 top
C22  80.01,13.34 0 top
C23  83.19,17.14 90 top
C24  72.39,10.16 270 top
C25  85.72,17.14 90 top
D2  27.08,37.44 90 top
D3  77.47,19.05 180 top
FB1  48.58,24.77 90 top
H1  31.43,22.86 0 top
H2  31.43,3.81 0 top
IC1  81.99,26.29 90 top
IC2  84.45,60.64 180 top
IC4  73.66,40.96 90 top
IC5  20.07,34.03 90 top
IC6  82.23,40.96 90 top
JP1  60.96,59.69 90 top
L1  76.83,8.89 270 top
MCU  40.65,32.7 180 top
PTC2  74.3,28.57 90 top
Q1  40.96,43.56 180 top
Q2  84.45,52.39 270 top
Q3  26.23,32.23 270 top
Q4  64.17,59.95 0 bottom
R1  78.14,25.22 180 top
R2  10.1,27.17 180 bottom
R3  10.11,29.72 180 bottom
R4  65.35,56.42 90 bottom
R5  63.15,56.47 270 bottom
R6  76.2,27.94 90 top
R7  10.1,32.26 0 bottom
R8  84.53,31.05 0 top
R9  84.53,32.64 0 top
R10  87.31,53.02 90 top
R11  80.64,52.7 0 top
R12  10.16,42.23 0 bottom
R13  10.16,44.77 0 bottom
R14  10.1,34.8 0 bottom
R15  10.1,37.18 0 bottom
R16  10.1,39.88 0 bottom
R17  86.04,9.84 270 top
R18  23.02,37.46 180 top
R19  24.96,29.37 180 top
R20  83.82,6.35 270 top
R21  82.55,6.35 270 top
R22  28.96,38.49 90 top
R23  83.19,13.34 0 top
S1  95.25,9.84 270 top
S2  28.05,42.83 180 top
U2  83.19,10.16 90 top
U3  76.2,15.24 270 top
U$1  6.1,28.38 90 top
U$4  58.61,39.95 90 top
U$11  6.03,43.5 90 top
U$18  6.1,33.46 90 top
U$19  6.1,38.54 90 top
X1  94.72,22.92 180 top
X2  95.57,38.1 270 top
XB1  83.41,59.35 270 top
Z1  76.83,32.07 0 top
Z2  76.83,34.92 0 top

### Tracks (layer width: path | path; a pad name or v marks a point on that pad's centre or on a via)
1D+
  Top 0.508: X1.3 89.47,22.92 89.22,23.18 89.22,28.89 88.58,29.53 88.58,30.8 87.31,32.07 86.36,32.07 85.79,32.64 R9.2
1D-
  Top 0.508: X1.2 88.68,22.12 88.27,22.54 88.27,28.57 87.63,29.21 87.63,30.48 87.06,31.05 R8.2
3.3V  (via drill 0.38)
  Top 0.508: v84.39,67.31 84.43,66.71 IC2.2 84.45,63.77 84.45,61.91 87.31,59.05 R10.2 | C9.1 v84.39,67.31 | v92.39,67.31 v84.39,67.31
  Bottom 0.508: v84.39,67.31 84.41,67.36 XB1.5 | XB1.1 92.39,70.34 v92.39,67.31
5.0V  (via drill 0.38)
  Top 0.406: C13.2 81.36,36.44 81.28,36.51 | IC4.14 C14.1 68.82,35.64 v68.9,35.56 | IC6.14 80.64,37.15 81.28,36.51 | 81.28,36.51 81.28,34.48 v81.79,33.97
  Top 0.508: FB1.1 48.64,23.81 50.48,23.81 52.07,25.4 52.07,28.57 | MCU.14 43.05,35.9 | 36.51,35.9 MCU.24 33.57,35.9 C19.1 C16.1 29.12,37.47 R22.1 28.96,37.61 D2.C 26.89,35.93 23.87,35.93 | 36.51,35.9 43.05,35.9 | MCU.34 36.65,35.77 36.51,35.9 | 43.05,35.9 43.05,29.98 43.52,29.5 MCU.2 51.78,29.5 52.07,29.21 52.07,28.57 | 23.87,35.93 R18.1 23.87,40.27 v23.81,40.32 | 23.87,35.93 IC5.4 21.01,35.93 20.64,35.56 20.64,34.29 18.47,32.12 IC5.8 | IC2.3 79.69,63.79 | 79.69,63.79 70.78,63.79 v68.58,61.59 | C2.1 79.76,63.86 79.69,63.79 | v61.28,28.57 52.07,28.57
  Top 0.61: 86.04,15.43 C25.1 | C25.1 C23.1 82.36,15.74 79.82,18.29 D3.C 79.82,20.83 78.11,22.54 67.31,22.54 v61.28,28.57 | R17.1 86.04,11.11 86.36,11.43 86.36,15.11 C25.1
  Bottom 0.406: X2.1 90.73,41.67 | X2.2 90.73,41.67 | 90.73,41.67 90.73,42.94 87.31,46.35 66.67,46.35 | 64.14,36.2 64.77,35.56 v68.9,35.56 70.48,33.97 v81.79,33.97
  Bottom 0.508: Q4.3 65.42,60.95 66.67,59.69 | 66.67,59.69 66.67,46.35 66.67,38.73 64.14,36.2 61.28,33.34 v61.28,28.57 | v68.58,61.59 66.67,59.69 | R16.1 13.93,42.86 21.27,42.86 v23.81,40.32
+UB  (via drill 0.5)
  Top 0.508: MCU.7 50.65,33.5 51.12,33.97 v64.45,33.97 | C10.2 80.69,28.23 IC1.4 77.96,27.24 C8.1 76.22,27.07 R6.1 74.38,27.09 PTC2.1 73.85,27.18 73.66,26.99 v71.44,26.99
  Bottom 0.406: U$1.ANODE1 6.1,30.92 8.95,30.92
  Bottom 0.508: v64.45,33.97 v71.44,26.99 70.8,26.35 60.33,26.35 51.12,17.14 25.4,17.14 20.32,22.23 12.7,22.23 12.06,22.86 12.06,30.48 11.62,30.92 8.95,30.92
ASSOC  (via drill 0.38)
  Top 0.508: v68.26,50.48 v57.47,50.48
  Bottom 0.508: XB1.15 82.41,49.04 80.96,50.48 v68.26,50.48 | v57.47,50.48 57.15,50.48 55.56,48.9 24.77,48.9 19.68,43.81 13.65,43.81 12.06,42.23 R12.1
BAT-ADC  (via drill 0.5)
  Top 0.406: 37.78,23.62 48.07,13.34 v54.61,13.34
  Top 0.508: MCU.36 38.25,25.1 37.78,24.64 37.78,23.62
  Top 0.61: IC1.3 84.96,27.24 | 84.96,27.24 C11.1 | 84.96,27.24 86.11,27.24 86.36,26.99 86.36,21.91 89.22,19.05 89.22,14.61 87.63,13.02 87.63,10.48 88.27,9.84 S1.2
  Bottom 0.406: v54.61,13.34 54.94,13.66 BAT1.PWR@1
  Bottom 1.016: BAT1.PWR@1 70.64,9.84 S1.2
CHRG-DONE-LED
  Bottom 0.508: U$1.ANODE2 9.19,29.65 R3.1
D+
  Top 0.508: 77.79,33.97 69.85,33.97 68.58,32.7 58.42,32.7 56.82,31.1 MCU.4 | 77.79,33.97 80.01,33.97 81.34,32.64 R9.1 | Z2.2 77.79,34.82 77.79,33.97
D-
  Top 0.508: MCU.3 57.29,30.3 58.74,31.75 68.9,31.75 70.17,33.02 77.79,33.02 | 77.79,33.02 79.69,33.02 80.96,31.75 82.55,31.75 83.25,31.05 R8.1 | Z1.2 77.79,32.17 77.79,33.02
GND  (via drill 0.38)
  Top 0.406: 37.45,25.74 37.45,28.3 arc-90 37.97,28.83 | Q2.2 84.52,51.44 84.84,51.12 | U2.4 84.15,8.27 84.14,8.26 85.09,8.26
  Top 0.508: MCU.43 43.85,25.69 44.13,25.4 | MCU.35 37.45,25.74 37.47,25.72 | MCU.15 42.25,37.17 42.23,37.15 | MCU.5 44.93,31.9 44.77,32.07 | C10.1 77.86,28.89 C8.2 | 75.98,28.57 74.93,28.57
  Top 0.61: R6.2 75.98,28.57
  other vias: 47.94,43.5 6.34,25.42 47.31,38.42 50.48,26.35 20.64,29.53 97.16,49.21 34.29,39.05 84.45,54.93 56.2,32.38 36.45,24.83 44.7,34.35 44.7,32.45 44.7,22.92 81.28,38.42 81.28,39.69 74.3,31.75 70.8,31.75 72.39,28.26 85.09,23.81 77.47,20 77.47,19.05 78.11,16.83 79.38,16.83 78.74,14.61 79.69,14.61 80.64,14.61 81.6,14.61 74.3,13.97 74.61,12.38 73.03,12.7 71.75,12.7 80.01,5.4 80.01,7.3 82.55,20.32 83.82,20.32 85.09,20.32 86.36,20.32 85.09,7.94 90.49,16.51 91.76,16.51 93.03,16.51 98.74,16.51 97.47,16.51 96.2,16.51
  pour Top: 0,72.33 100.14,72.33 100.14,3.12 0.13,3.12
  pour Bottom: 0,72.33 100.14,72.33 100.14,3.12 0.13,3.12
LASER  (via drill 0.38)
  Top 0.508: v39.05,24.13 MCU.37
  Bottom 0.508: v39.05,24.13 48.26,24.13 48.58,23.81 50.48,23.81 65.35,38.68 R4.1
LED1  (via drill 0.38)
  Top 0.508: v31.75,30.16 32.69,31.1 MCU.30
  Bottom 0.508: R7.1 10.99,32.26 12.38,33.66 12.38,34.92 14.29,36.83 14.29,39.05 15.24,40.01 19.37,40.01 28.26,31.11 30.8,31.11 v31.75,30.16
LED2  (via drill 0.38)
  Top 0.508: v31.75,32.07 31.91,31.9 MCU.29
  Bottom 0.508: R14.1 10.99,34.8 13.34,37.15 13.34,39.37 14.92,40.96 19.68,40.96 28.57,32.07 v31.75,32.07
LED3  (via drill 0.38)
  Top 0.508: v31.75,33.97 33.02,32.7 MCU.28
  Bottom 0.508: v31.75,33.97 30.8,33.02 28.89,33.02 19.97,41.95 14.64,41.95 12.38,39.69 12.38,37.78 11.78,37.18 R15.1
MISO
  Top 0.508: MCU.11 54.22,36.7 U$4.1
MOSD
  Top 0.406: U3.5 U3.6 77.11,15.24 76.83,15.24 | 76.83,16.51 76.81,16.48 U3.2 | 82.11,11.65 82.2,11.62 U2.8
  Top 0.508: 76.83,16.51 77.11,16.51 U3.1
  Top 0.61: L1.P$1 82.06,11.64 82.11,11.65
  Top 1.016: L1.P$1 76.83,15.24 76.83,16.51 76.83,17.34 D3.A
MOSI  (via drill 0.38)
  Top 0.508: MCU.10 44.74,35.9 v44.45,36.2
  Bottom 0.508: v44.45,36.2 50.8,36.2 52.07,34.92 59.69,34.92 63.5,38.73 63.5,41.91 62.23,43.18 60.7,43.18 U$4.4
N$1
  Top 0.406: U2.3 83.52,7.42 R20.1
  Top 0.508: R17.2 86.04,7.3 85.72,6.99 83.95,6.99 R20.1
N$2
  Top 0.406: C12.2 82.55,3.94 R21.2
N$3
  Top 0.508: IC1.5 79.11,25.34 R1.1
N$4  (via drill 0.5)
  Top 0.508: v82.55,24.13 83.28,24.86 IC1.1
  Bottom 0.508: R3.2 10.96,27.18 | 10.96,27.18 R2.2 | 10.96,27.18 10.96,22.38 12.06,21.27 20,21.27 25.08,16.19 51.44,16.19 60.64,25.4 80.33,25.4 81.6,24.13 v82.55,24.13
N$5
  Bottom 0.508: JP1.1 61.13,57.32 R5.1 63.23,57.39 Q4.2
N$6
  Bottom 0.508: R4.2 65.12,57.49 Q4.1
N$7
  Top 0.508: MCU.44 44.65,26.16 45.02,25.78 C5.2 FB1.2
N$8  (via drill 0.38)
  Top 0.406: U2.5 84.72,11.38 v85.09,11.75 | v74.3,15.24 74.93,15.24 75.25,15.56 75.25,16.47 U3.3
  Bottom 0.406: v85.09,11.75 77.79,11.75 v74.3,15.24
N$9
  Top 0.508: MCU.42 43.05,24.5 C1.1
N$12
  Top 0.508: MCU.6 51.82,32.7 C3.2
N$13
  Top 0.508: X1.1 88.21,21.32 87.31,22.23 87.31,28.26 85.72,29.84 82.87,29.84 81.92,30.8 75.12,30.8 PTC2.2 C4.1
N$14
  Bottom 0.508: U$1.CATHODE1 4.83,24.36 5.28,23.91 8.89,23.91 9.25,24.27 R2.1
N$15
  Bottom 0.508: U$18.ANODE1 6.1,33.47 8.04,33.47 R7.2
N$17
  Bottom 0.508: R12.2 8.04,43.5 6.03,43.5 U$11.ANODE1
N$18
  Top 0.508: R11.2 82.13,53.34 Q2.1
N$19
  Bottom 0.508: R13.2 U$11.ANODE2
N$20  (via drill 0.38)
  Top 0.406: IC4.1 76.73,36.93 77.85,35.81 v79.69,35.81
  Bottom 0.406: v79.69,35.81 87.93,35.81 X2.4
N$21
  Bottom 0.508: U$18.ANODE2 9.18,34.73 R14.2
N$22  (via drill 0.38)
  Top 0.406: v86.81,33.66 86.81,36.83 86.49,37.15 IC6.1
  Bottom 0.406: X2.5 92.52,37.59 92.08,37.15 92.08,33.34 91.44,32.7 87.76,32.7 v86.81,33.66
N$25
  Bottom 0.508: U$19.ANODE1 6.09,38.55 7.88,38.55 R15.2
N$27
  Top 0.406: U2.2 82.86,7.42 R21.1 C21.2
N$28
  Top 0.406: IC6.2 82.87,38.42 82.55,38.73 82.55,45.09 81.6,46.04 74.93,46.04 74.3,45.4 74.3,39.05 74.93,38.42 IC4.2
N$29
  Top 0.406: U2.7 82.86,12.9 R23.1 C22.2
N$32
  Bottom 0.508: U$19.ANODE2 9.25,39.81 R16.2
N$36
  Top 0.508: R18.2 22.12,37.5 C17.1 19.68,37.26 19.68,35.56 18.79,34.66 IC5.6 IC5.7 15.93,33.39 15.56,33.02 15.56,31.43 18.73,28.26 22.23,28.26 23.34,29.37 R19.2
N$41
  Top 0.508: Q3.3 27.23,30.79 R19.1
PT-IN  (via drill 0.38)
  Top 0.508: Q3.1 25.23,33.39 IC5.2 21.01,33.39 18.73,31.11 v18.73,30.16 | v15.88,38.42 25.4,47.94 58.42,47.94 v58.74,48.26
  Bottom 0.508: JP1.2 59.69,59.69 58.74,58.74 v58.74,48.26 | v15.88,38.42 15.88,33.02 v18.73,30.16
PT-OUT  (via drill 0.38)
  Top 0.508: IC5.3 25.66,34.66 26.04,34.29 28.57,34.29 v29.53,35.24 | v50.48,28.26 50.04,28.7 MCU.1
  Bottom 0.508: v29.53,35.24 32.38,35.24 39.37,28.26 v50.48,28.26
REMOTE-LASER
  Top 0.406: MCU.19 39.05,39.66 38.92,39.78 38.92,40.42 38.07,41.27 37.15,41.27 35.88,42.55 35.88,45.09 36.2,45.4 67.94,45.4 69.53,46.99 81.92,46.99 83.5,45.4 83.5,40.01 83.82,39.69 IC6.3
RSSI  (via drill 0.38)
  Top 0.508: v68.26,52.39 v57.47,52.39
  Bottom 0.508: XB1.6 82.41,57.64 77.15,52.39 v68.26,52.39 | v57.47,52.39 54.93,49.85 24.45,49.85 19.37,44.77 R13.1
RST  (via drill 0.38)
  Top 0.508: R22.2 28.76,39.14 D2.A 27.08,42.13 26.83,42.39 | MCU.13 43.85,39.72 44.13,40.01 v46.35,40.01 | 26.83,42.39 26.38,42.83 S2.P$2 | v28.89,45.72 28.89,44.45 26.83,42.39
  Bottom 0.508: v46.35,40.01 48.9,40.01 | 48.9,40.01 48.9,44.45 46.67,46.67 29.84,46.67 v28.89,45.72 | U$4.5 58.79,36.2 52.7,36.2 48.9,40.01
RX2  (via drill 0.38)
  Top 0.508: MCU.20 38.25,40.18 37.78,40.64 36.83,40.64 34.92,42.55 34.92,45.4 35.56,46.04 67.31,46.04 71.36,50.08 v90.41,50.08
  Bottom 0.508: XB1.2 v90.41,50.08
SCK
  Top 0.508: MCU.9 56.5,35.1 58.61,37.21 U$4.3
TX2
  Top 0.508: MCU.21 37.45,39.39 37.15,39.69 36.51,39.69 33.97,42.23 33.97,45.72 35.24,46.99 66.99,46.99 72.71,52.7 R11.1
TX2L  (via drill 0.38)
  Top 0.508: v88.9,52.39 88.69,52.17 R10.1 85.67,52.17 Q2.3
  Bottom 0.508: v88.9,52.39 88.9,69.86 XB1.3
VBAT  (via drill 0.9)
  Top 0.406: 81.92,8.57 82.22,8.88 U2.1 82.22,9.83 82.55,10.16 83.19,10.16 83.52,10.49 U2.6 83.52,12.9 R23.2
  Top 0.61: 81.92,8.57 79.27,8.57 L1.P$2 75.39,6.14 C24.2
  Top 0.813: v76.83,4.13 L1.P$2
  Bottom 0.813: S1.1 92.71,12.38 93.34,11.75 93.34,5.71 91.76,4.13 v76.83,4.13
XTAL1  (via drill 0.38)
  Top 0.508: MCU.17 40.65,39.68 v40.01,40.32
  Bottom 0.508: v40.01,40.32 38.55,41.78 Q1.2 38.55,45.09 C7.2
XTAL2  (via drill 0.38)
  Top 0.508: MCU.16 41.45,39.86 v41.91,40.32
  Bottom 0.508: v41.91,40.32 43.38,41.79 Q1.1 45.26,43.56 C6.2

### Text on the board
tSilk: Laptimer Main unit / Version 1